# Altium schematic sheet monitor_sch..SchDoc
size A; SheetNumber: 1; SheetTotal: 1
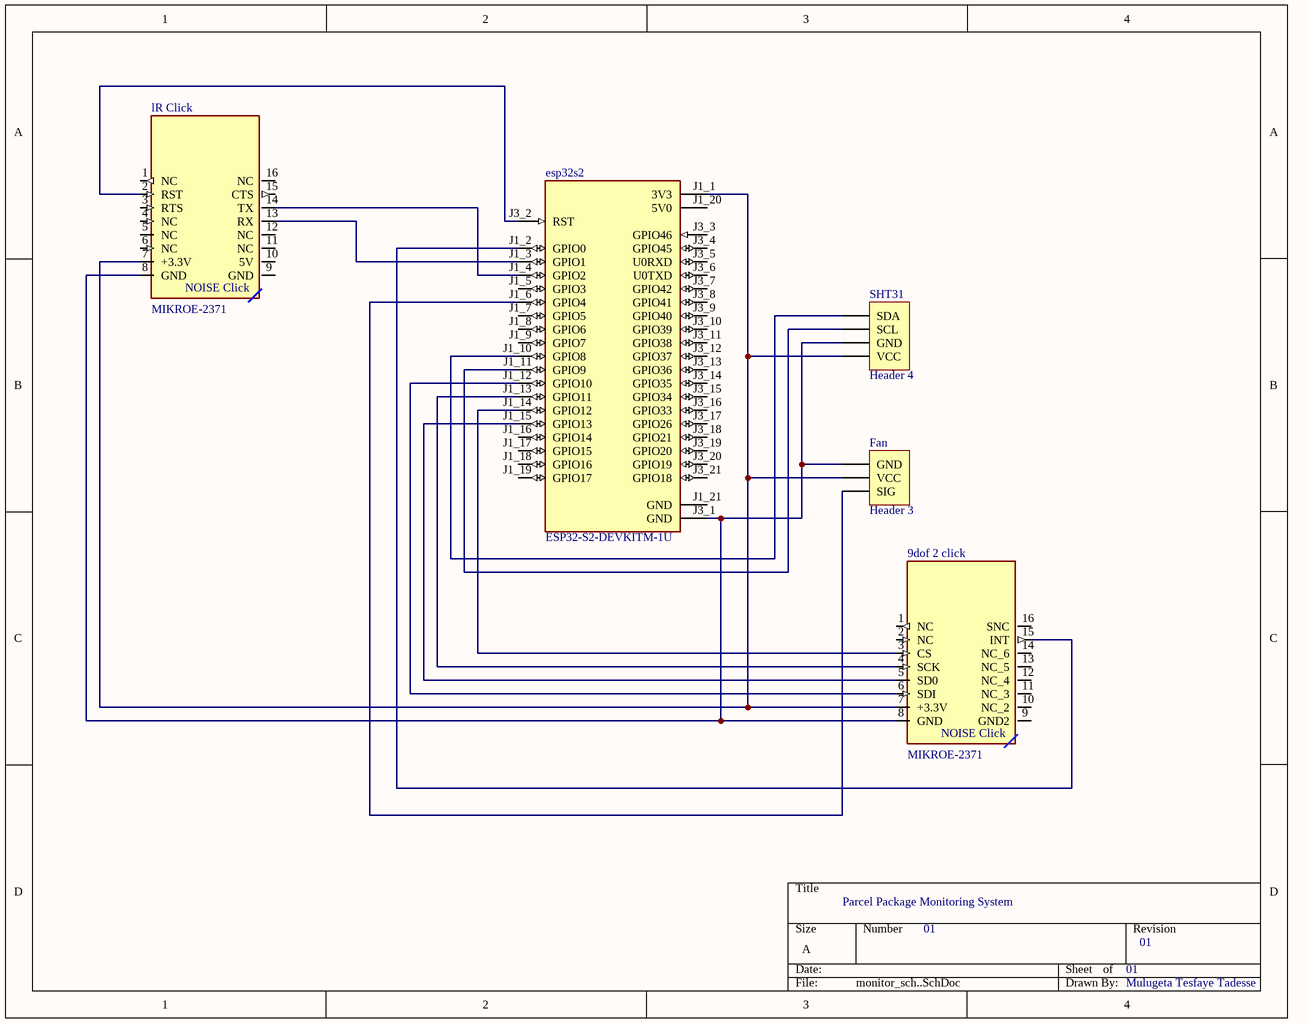
[diagram p0: monitor_sch..SchDoc]

## Parts
9dof_2_click  MIKROE-2371  [MIKROE-2371]
esp32s2  ESP32-S2-DEVKITM-1U  [XCVR_ESP32-S2-DEVKITM-1U]
Fan  Header 3  [HDR1X3]
lR_Click  MIKROE-2371  [MIKROE-2371]
SHT31  Header 4  [HDR1X4]

## Nets
Net9dof_2_click_3: 9dof_2_click.3(CS) esp32s2.J1_14(GPIO12)
Net9dof_2_click_4: 9dof_2_click.4(SCK) esp32s2.J1_13(GPIO11)
Net9dof_2_click_5: 9dof_2_click.5(SD0) esp32s2.J1_15(GPIO13)
Net9dof_2_click_6: 9dof_2_click.6(SDI) esp32s2.J1_12(GPIO10)
Net9dof_2_click_7: 9dof_2_click.7(+3.3V) esp32s2.J1_1(3V3) Fan.2(VCC) lR_Click.7(+3.3V) SHT31.4(VCC)
Net9dof_2_click_8: 9dof_2_click.8(GND) esp32s2.J3_1(GND) Fan.1(GND) lR_Click.8(GND) SHT31.3(GND)
Net9dof_2_click_15: 9dof_2_click.15(INT) esp32s2.J1_2(GPIO0)
Netesp32s2_J1_3: esp32s2.J1_3(GPIO1) lR_Click.13(RX)
Netesp32s2_J1_4: esp32s2.J1_4(GPIO2) lR_Click.14(TX)
Netesp32s2_J1_6: esp32s2.J1_6(GPIO4) Fan.3(SIG)
Netesp32s2_J1_10: esp32s2.J1_10(GPIO8) SHT31.1(SDA)
Netesp32s2_J1_11: esp32s2.J1_11(GPIO9) SHT31.2(SCL)
Netesp32s2_J3_2: esp32s2.J3_2(RST) lR_Click.2(RST)

Not connected (* = marked no-connect by the designer): 9dof_2_click 1(NC) 2(NC) 9(GND2) 10(NC_2) 11(NC_3) 12(NC_4) 13(NC_5) 14(NC_6) 16(SNC); esp32s2 J1_5(GPIO3) J1_7(GPIO5) J1_8(GPIO6) J1_9(GPIO7) J1_16(GPIO14) J1_17(GPIO15) J1_18(GPIO16) J1_19(GPIO17) J1_20(5V0) J1_21(GND) J3_3(GPIO46) J3_4(GPIO45) J3_5(U0RXD) J3_6(U0TXD) J3_7(GPIO42) J3_8(GPIO41) J3_9(GPIO40) J3_10(GPIO39) J3_11(GPIO38) J3_12(GPIO37) J3_13(GPIO36) J3_14(GPIO35) J3_15(GPIO34) J3_16(GPIO33) J3_17(GPIO26) J3_18(GPIO21) J3_19(GPIO20) J3_20(GPIO19) J3_21(GPIO18); lR_Click 1(NC) 3(RTS) 4(NC) 5(NC) 6(NC) 9(GND) 10(5V) 11(NC) 12(NC) 15(CTS) 16(NC)

## Notes on the sheet
- Parcel Package Monitoring System
- 01
- Mulugeta Tesfaye Tadesse
- (in symbol MIKROE-2371) NOISE Click

## Library data of the parts
9dof_2_click = MIKROE-2371: Noise Click Board | MikroElektronika MIKROE-2371; SnapEDA_Link: https://www.snapeda.com/parts/MIKROE-2371/MikroElektronika/view-part/?ref=snap; Package: None; Value: *; MF: MikroElektronika; MP: MIKROE-2371; Check_prices: https://www.snapeda.com/parts/MIKROE-2371/MikroElektronika/view-part/?ref=eda
esp32s2 = ESP32-S2-DEVKITM-1U: WiFi Development Tools (802.11) [ENGINEERING SAMPLES ONLY]General-Purpose Development Board, embeds ESP32-S2-MINI-1U, 4 MB flash; MF: Espressif Systems; SnapEDA_Link: https://www.snapeda.com/parts/ESP32-S2-DEVKITM-1U/Espressif+Systems/view-part/?ref=snap; Package: None; Value: *; MP: ESP32-S2-DEVKITM-1U; Check_prices: https://www.snapeda.com/parts/ESP32-S2-DEVKITM-1U/Espressif+Systems/view-part/?ref=eda
Fan = Header 3: Header, 3-Pin; LatestRevisionDate: 17-Jul-2002; LatestRevisionNote: Re-released for DXP Platform.; Publisher: Altium Limited
lR_Click = MIKROE-2371: Board | MikroElektronika MIKROE-2371; SnapEDA_Link: https://www.snapeda.com/parts/MIKROE-2371/MikroElektronika/view-part/?ref=snap; Package: None; Value: *; MF: MikroElektronika; MP: MIKROE-2371; Check_prices: https://www.snapeda.com/parts/MIKROE-2371/MikroElektronika/view-part/?ref=eda
SHT31 = Header 4: Header, 4-Pin; LatestRevisionDate: 17-Jul-2002; LatestRevisionNote: Re-released for DXP Platform.; Publisher: Altium Limited